# Altium schematic sheet RS485.SchDoc: RP2040 CNC
size B; Author: AM; CompanyName: Expatria Technologies; DrawnBy: A.Marles; Engineer: AM; Organization: Expatria Technolgoies; DocumentNumber: 3; SheetNumber: 3; SheetTotal: 5
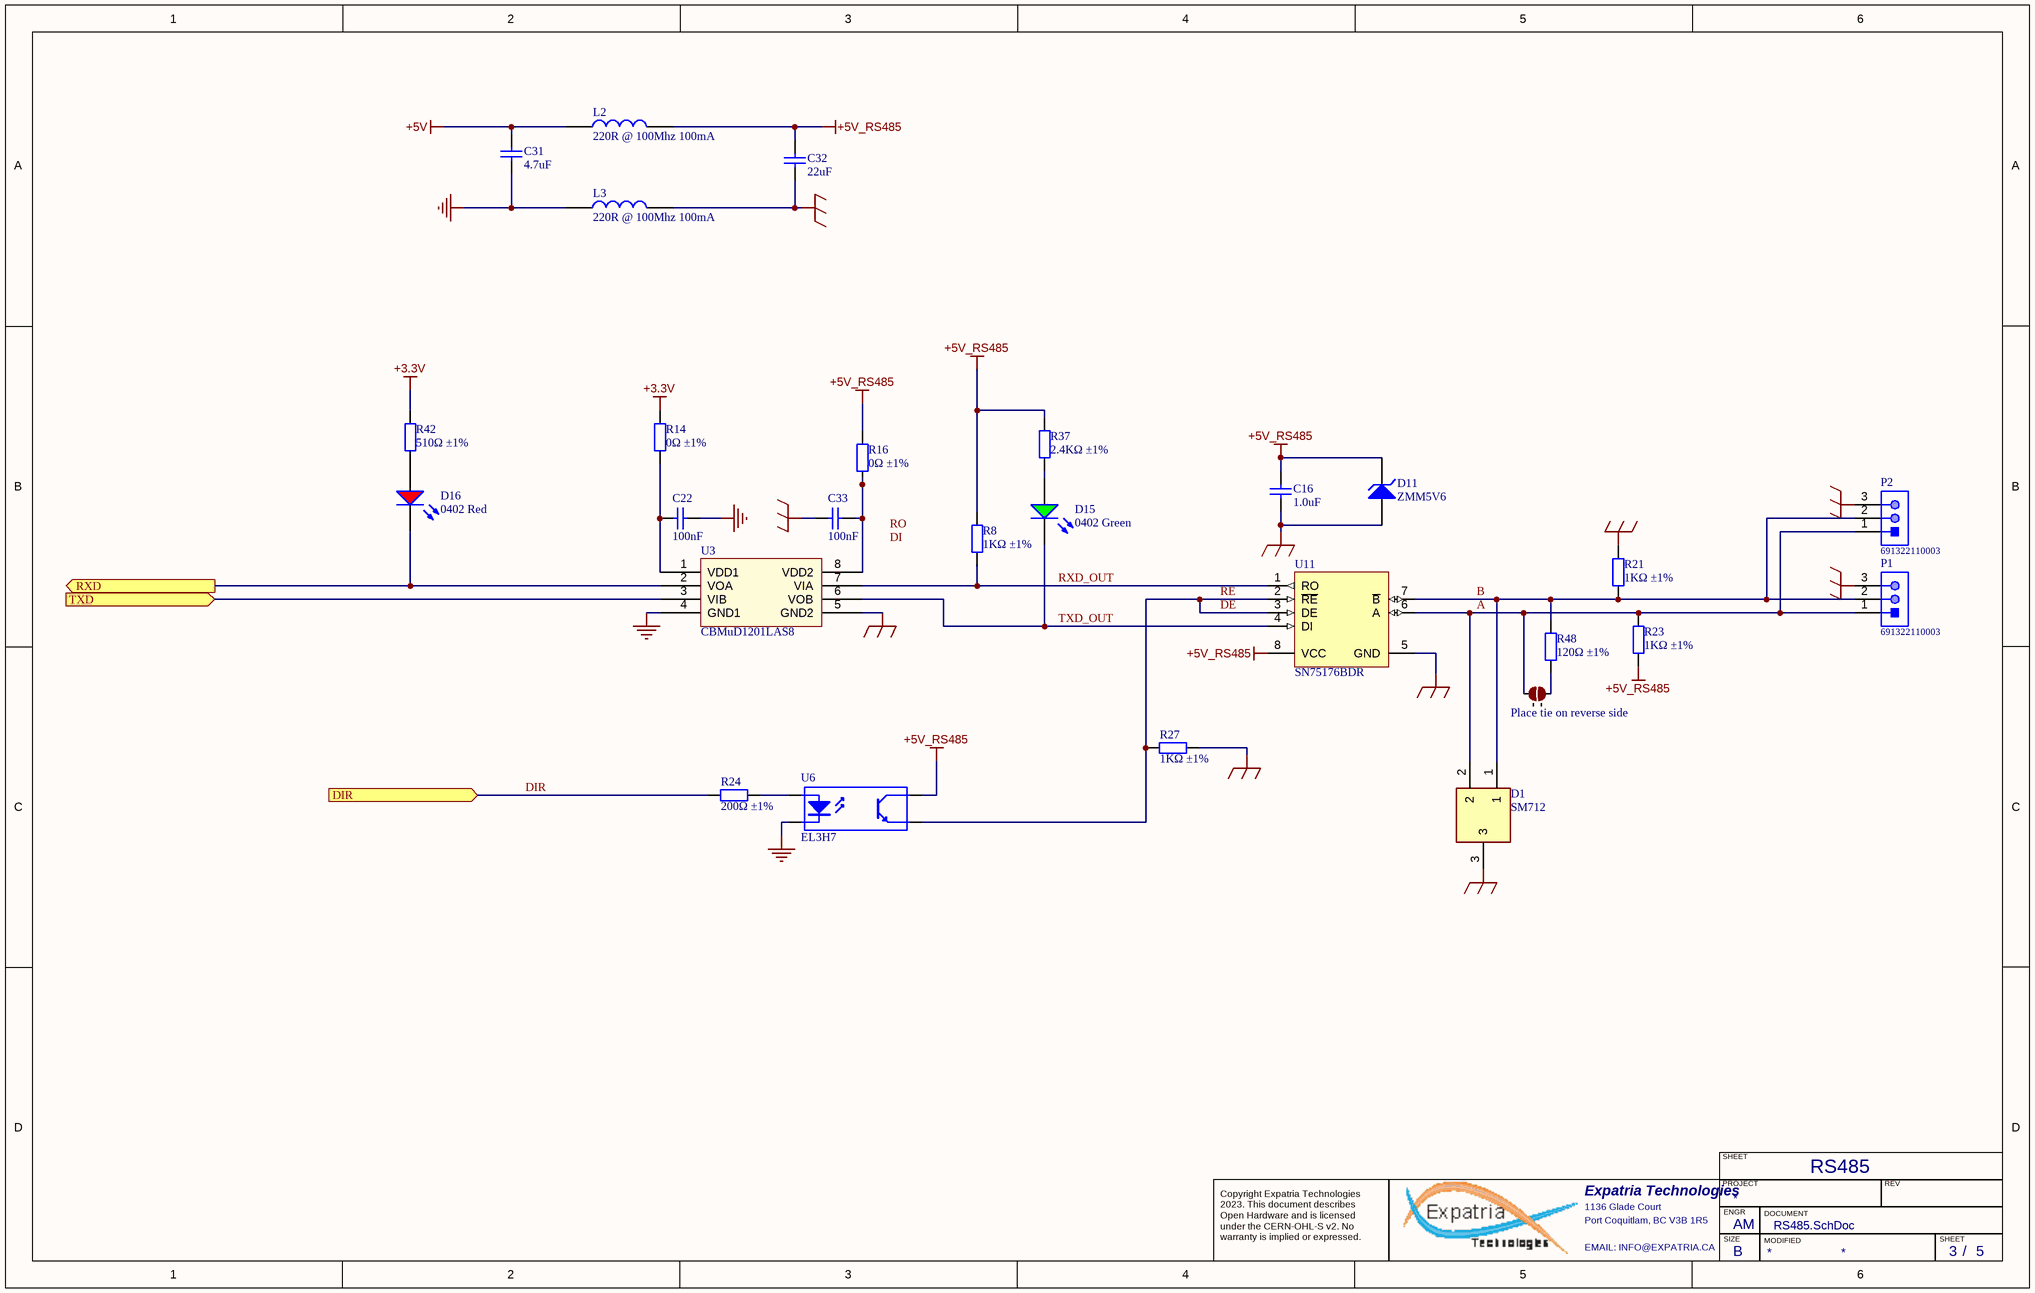
[diagram p0: RS485.SchDoc]

## Parts
C16  1.0uF  [0402_C]
C22  100nF  [0402_C]
C31  4.7uF  [0805_C]
C32  22uF  [0805_C]
C33  100nF  [0402_C]
D1  SM712  [SOT95P230X117-3N]
D11  ZMM5V6  [LL-34]
D15  0402 Green  [LED 0402_1005 RED]
D16  0402 Red  [LED 0402_1005 RED]
J4  2 way net solder junction - Normally Open  [2waySolder_NO]  (value not drawn)  (no BOM)
L2  220R @ 100Mhz 100mA  [0402_L]
L3  220R @ 100Mhz 100mA  [0402_L]
P1  691322110003  [691322110003]
P2  691322110003  [691322110003]
R8  1KΩ ±1%  [0402_R]
R14  0Ω ±1%  [0402_R]
R16  0Ω ±1%  [0402_R]
R21  1KΩ ±1%  [0402_R]
R23  1KΩ ±1%  [0402_R]
R24  200Ω ±1%  [0402_R]
R27  1KΩ ±1%  [0402_R]
R37  2.4KΩ ±1%  [0402_R]
R42  510Ω ±1%  [0402_R]
R48  120Ω ±1%  [0805_R]
U3  CBMuD1201LAS8  [SOIC-8_150mil]
U6  EL3H7  [SOIC127P700X200-4N]
U11  SN75176BDR  [SOIC-8_150mil]

## Ports
DIR (in), RXD (out), TXD (in)

## Nets
+3.3V: R14.2 R42.1
+5V: C31.2 L2.1
+5V_RS485: C16.2 C32.2 D11.2(K) L2.2 R8.2 R16.2 R23.1 R37.2 U6.4(C) U11.8(VCC)
GND: C22.2 C31.1 L3.1 U3.4(GND1) U6.2(K)
MOD_GND: C16.1 C32.1 C33.1 D1.3 D11.1(A) L3.2 P1.3 P2.3 R21.2 R27.2 U3.5(GND2) U11.5(GND)
A: D1.2 J4.1 P1.1 P2.1 R23.2 U11.6(A)
B: D1.1 P1.2 P2.2 R21.1 R48.2 U11.7(~{B})
DE: R27.1 U6.3(E) U11.2(~{RE}) U11.3(DE)  [also labelled RE]
DIR: R24.2 ; port DIR
RXD: D16.K U3.2(VOA) ; port RXD
RXD_OUT: R8.1 U3.7(VIA) U11.1(RO)
TXD: U3.3(VIB) ; port TXD
TXD_OUT: D15.K U3.6(VOB) U11.4(DI)
NetC22_1: C22.1 R14.1 U3.1(VDD1)
NetC33_2: C33.2 R16.1 U3.8(VDD2)
NetD15_A: D15.A R37.1
NetD16_A: D16.A R42.2
NetJ4_2: J4.2 R48.1
NetR24_1: R24.1 U6.1(A)

## Notes on the sheet
- (near J4) Place tie on reverse side
- RS485
- Labels drawn without touching a wire or pin: DI, RO
- SHEET
- Expatria Technologies
- 1136 Glade Court
- Port Coquitlam, BC V3B 1R5
- PROJECT
- SIZE
- ENGR
- MODIFIED
- DOCUMENT
- REV
- Copyright Expatria Technologies 2023. This document describes Open Hardware and is licensed under the CERN-OHL-S v2. No warranty is implied or expressed.
- EMAIL: INFO@EXPATRIA.CA
- B
- /

## Library data of the parts
C16 = 0402 1.0uF (105) 10% 25V: Chip capacitor; Manufacturer: Samsung Electro-Mechanics; PartNumber: CL05A105KA5NQNC; Capacitance: 1uF; Tolerance: 10%; Voltage: 25V; ComponentLink1Description: Supplier link; ComponentLink1URL: http://www.szlcsc.com/product/details_53938.html; Package: 0402; Supplier: LC; SuppliersPartNumber: C52923
C22 C33 = 0402 100nF (104) 10% 16V: Chip capacitors; Manufacturer: Samsung Electro-Mechanics; PartNumber: CL05B104KO5NNNC; Tolerance: 10%; Voltage: 16V; ComponentLink1Description: Supplier link; ComponentLink1URL: http://www.szlcsc.com/product/details_1877.html; Package: 0402; Supplier: LC; SuppliersPartNumber: C1525; Capacitance: 100nF
C31 = 0805 4.7uF (475) 10% 25V: Chip capacitors; Manufacturer: Samsung Electro-Mechanics; PartNumber: CL21A475KAQNNNE; Tolerance: 10%; Voltage: 25V; ComponentLink1Description: Supplier link; ComponentLink1URL: http://www.szlcsc.com/product/details_2131.html; Package: 0805; Supplier: LC; SuppliersPartNumber: C1779; Capacitance: 4.7uF
C32 = 0805 22uF (226) 20% 25V: Chip capacitors; Manufacturer: Samsung Electro-Mechanics; PartNumber: CL21A226MAQNNNE; Tolerance: 20%; Voltage: 25V; ComponentLink1Description: Supplier link; ComponentLink1URL: http://www.szlcsc.com/product/details_46786.html; Package: 0805; Supplier: LC; SuppliersPartNumber: C45783; Capacitance: 22uF
D1 = CDSOT23-SM712: Bidirectional 12V (Max), 7V (Max) 7.5V / 13.3V 10V / 20V 12A(8/20us) SOT-23-3 TVS RoHS; Manufacturer_Name: DOWO; Height: 1.17mm; Manufacturer_Part_Number: SM712; SuppliersPartNumber: C293966
D11 = LL-34 ZMM5V6: 500mW - 0.1uA @ 1V 5.6V LL-34 Zener Diodes ROHS; ComponentLink1Description: 供应商链接; ComponentLink1URL: http://www.szlcsc.com/product/details_8541.html; Package: LL-34; Supplier: LC; SuppliersPartNumber: C8062
D15 = 0402 LED Green: LED; Package: 0402; Supplier: LC; SuppliersPartNumber: C130723; Color: Green
D16 = 0402 LED Red: LED; Package: 0402; Supplier: LC; SuppliersPartNumber: C130720; Color: Red
J4 = 2waySolderNO: ComponentLink1URL: http://www.edatools.cz/addons; ComponentLink1Description: Source
L2 L3 = 0402 220R@100Mhz 0.1A: Ferrite Bead; Notepad: *; Package: 0402; Supplier: LC; SuppliersPartNumber: C92617
P1 = CMP-1502-01792-1: Serie 3221 - 3.50mm Horizontal PCB Header WR-TBL, 3 pin; Manufacturer: Wurth Elektronik; Pin Number: 3; Gender: Male; Part Number: 691322110003; Pitch: 3.50mm; Manufacturer URL: http://www.we-online.de; Packaging: Box; Operating Temperature: -40to105degC; Datasheet URL: http://katalog.we-online.de/em/datasheet/6913221100xx.pdf; Publisher: WurthElektronik; Mounting Technology: THT; Package Reference: 691322110003; SuppliersPartNumber: C430551
P2 = CMP-1502-01792-1: Serie 3221 - 3.50mm Horizontal PCB Header WR-TBL, 3 pin; SuppliersPartNumber: C880573
R8 R21 R23 R27 = 0402 1K (1001) 1%: Chip resistor; Manufacturer: Uniroyal Elec; PartNumber: 0402WGF1001TCE; Power: 1/16W; ComponentLink1Description: Supplier link; ComponentLink1URL: http://www.szlcsc.com/product/details_12256.html; Package: 0402; Supplier: LC; SuppliersPartNumber: C11702; Resistance: 1KΩ; Tolerance: 1%
R14 R16 = 0402 0R (0R0) 1%: Chip resistor; Manufacturer: Uniroyal Elec; PartNumber: 0402WGF0000TCE; Power: 1/16W; Package: 0402; Supplier: LC; SuppliersPartNumber: C17168; Resistance: 0Ω; Tolerance: 1%; ComponentLink1Description: Supplier link; ComponentLink1URL: http://www.szlcsc.com/product/details_17853.html
R24 = 0402 200R (2000) 1%: Chip resistor; Manufacturer: Uniroyal Elec; PartNumber: 0402WGF2000TCE; Power: 1/16W; Package: 0402; Supplier: LC; SuppliersPartNumber: C25087; Resistance: 200Ω; Tolerance: 1%; ComponentLink1Description: Supplier link; ComponentLink1URL: http://www.szlcsc.com/product/details_25830.html
R37 = 0402 2.4K (2401) 1%: Chip resistor; Manufacturer: Uniroyal Elec; PartNumber: 0402WGF2401TCE; Power: 1/16W; ComponentLink1Description: Supplier link; ComponentLink1URL: http://www.szlcsc.com/product/details_26625.html; Package: 0402; Supplier: LC; SuppliersPartNumber: C25882; Resistance: 2.4KΩ; Tolerance: 1%
R42 = 0402 510R (5100) 1%: Chip resistor; Manufacturer: Uniroyal Elec; PartNumber: 0402WGF5100TCE; Power: 1/16W; Package: 0402; Supplier: LC; SuppliersPartNumber: C25123; Resistance: 510Ω; Tolerance: 1%
R48 = 0805 120R (1200) 1%: Chip resistor; Manufacturer: Uniroyal Elec; Power: 1/8W; ComponentLink1Description: Supplier link; ComponentLink1URL: http://www.szlcsc.com/product/details_18125.html; Package: 0805; Supplier: LC; SuppliersPartNumber: C17437; Tolerance: 1%
U3 = CBMuD1201LAS8: Dual Channel Isolator; Package: SOIC-8_150mil; Supplier: LC; SuppliersPartNumber: C476472; ComponentLink1Description: 供应商链接; ComponentLink1URL: http://www.szlcsc.com/product/details_10199.html
U6 = EL3H7(C)(TA)-G_[C92243]: 80V -55℃~+110℃ 50mA 3us@2mA,100Ω 5us@2mA,100Ω 0.1V@1mA,10mA 1 6V 1.2V 光电三极管 DC 3750V SSOP-4 Optocouplers - Phototransistor Output ROHS; ComponentLink1Description: 供应商链接; ComponentLink1URL: http://www.szlcsc.com/product/details_7114.html; Package: SSOP-4; Supplier: LC; SuppliersPartNumber: C92243
U11 = SN75176BDR_[C7063]: RS-485/RS-422; ComponentLink1Description: 供应商链接; ComponentLink1URL: http://www.szlcsc.com/product/details_7535.html; Package: SOIC-8_150mil; Supplier: LC; SuppliersPartNumber: C7063